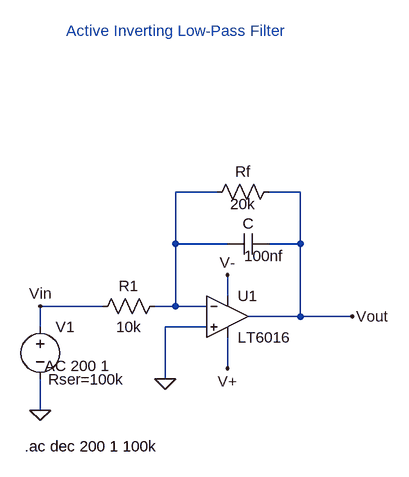
[diagram p0: schematic Active Inverting Low-Pass Filter.asc]
Active Inverting Low-Pass Filter.asc, the LTspice schematic file:
Version 4.1
SHEET 1 880 680
WIRE 128 32 64 32
WIRE 256 32 208 32
WIRE 64 112 64 32
WIRE 144 112 64 112
WIRE 256 112 256 32
WIRE 256 112 208 112
WIRE 144 192 144 160
WIRE -48 208 -144 208
WIRE 64 208 64 112
WIRE 64 208 32 208
WIRE 112 208 64 208
WIRE 256 224 256 112
WIRE 256 224 176 224
WIRE 336 224 256 224
WIRE -144 240 -144 208
WIRE 112 240 48 240
WIRE 144 304 144 256
WIRE 48 320 48 240
WIRE -144 368 -144 320
FLAG 48 320 0
FLAG -144 368 0
FLAG -144 208 Vin
FLAG 144 160 V-
FLAG 144 304 V+
FLAG 336 224 Vout
SYMBOL OpAmps\\LT6016 144 224 R0
SYMATTR InstName U1
SYMBOL res 48 192 R90
WINDOW 0 0 56 VBottom 2
WINDOW 3 32 56 VTop 2
SYMATTR InstName R1
SYMATTR Value 10k
SYMBOL res 224 16 R90
WINDOW 0 0 56 VBottom 2
WINDOW 3 50 56 VBottom 2
SYMATTR InstName Rf
SYMATTR Value 20k
SYMBOL cap 208 96 R90
WINDOW 0 0 32 VBottom 2
WINDOW 3 50 8 VBottom 2
SYMATTR InstName C
SYMATTR Value 100nf
SYMBOL voltage -144 224 R0
WINDOW 123 7 76 Left 2
WINDOW 39 12 97 Left 2
SYMATTR Value2 AC 200 1
SYMATTR SpiceLine Rser=100k
SYMATTR InstName V1
SYMATTR Value ""
TEXT -168 424 Left 2 !.ac dec 200 1 100k
TEXT -104 -216 Left 2 ;Active Inverting Low-Pass Filter

The netlist it stands for:
* Active Inverting Low-Pass Filter.asc
* U1: LT6016 (symbol OpAmps\LT6016 not available, pins judged from their places): In+=0 In-=N001 V+=V- V-=V+ OUT=Vout
R1 N001 Vin 10k
Rf Vout N001 20k
C Vout N001 100nf
V1 Vin 0 AC 200 1 Rser=100k
.ac dec 200 1 100k
* Active Inverting Low-Pass Filter
.backanno
.end